# Altium project Micromouse.PrjPcb
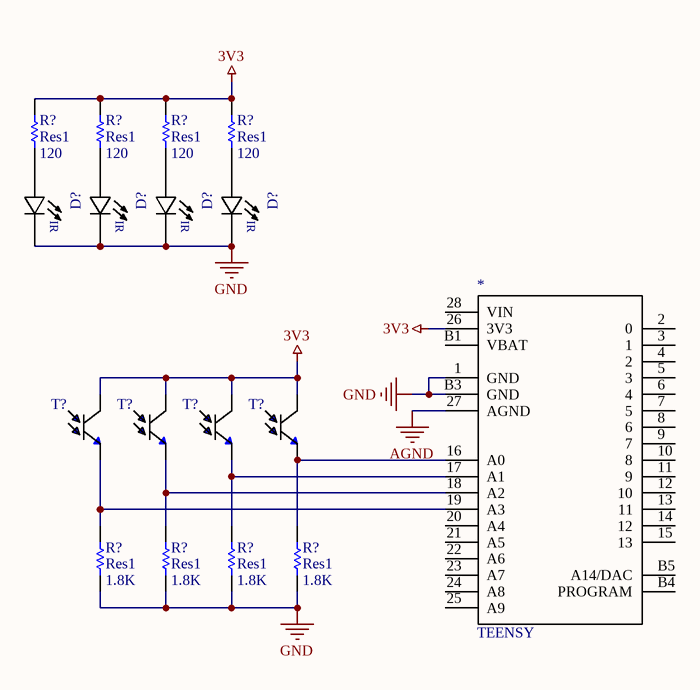
[diagram p0: Sheet1.SchDoc]
1 sheet, 17 parts. Net scope: global (net labels, ports and power ports of the same name join across sheets).

## Sheet Sheet1.SchDoc
size A

### Parts
(Parts that share a designator on the sheet are numbered #1, #2 ... from top to bottom, then left to right.)
*  TEENSY
D?#1  SFH_4545  [*DIO_SFH_4545_SFH_4545(Primary)]  (value not drawn)
D?#2  SFH_4545  [*DIO_SFH_4545_SFH_4545(Primary)]  (value not drawn)
D?#3  SFH_4545  [*DIO_SFH_4545_SFH_4545(Primary)]  (value not drawn)
D?#4  SFH_4545  [*DIO_SFH_4545_SFH_4545(Primary)]  (value not drawn)
R?#1  Res1  value 120  [AXIAL-0.3]
R?#2  Res1  value 120  [AXIAL-0.3]
R?#3  Res1  value 120  [AXIAL-0.3]
R?#4  Res1  value 120  [AXIAL-0.3]
R?#5  Res1  value 1.8K  [AXIAL-0.3]
R?#6  Res1  value 1.8K  [AXIAL-0.3]
R?#7  Res1  value 1.8K  [AXIAL-0.3]
R?#8  Res1  value 1.8K  [AXIAL-0.3]
T?#1  TEFT4300  [*XDCR_TEFT4300_TEFT4300(Primary)]  (value not drawn)
T?#2  TEFT4300  [*XDCR_TEFT4300_TEFT4300(Primary)]  (value not drawn)
T?#3  TEFT4300  [*XDCR_TEFT4300_TEFT4300(Primary)]  (value not drawn)
T?#4  TEFT4300  [*XDCR_TEFT4300_TEFT4300(Primary)]  (value not drawn)

### Nets
3V3: *.26(3V3) R?#1.2 R?#2.2 R?#3.2 R?#4.2 T?#1.C T?#2.C T?#3.C T?#4.C
AGND: *.27(AGND)
GND: *.1(GND) *.B3(GND) D?#1.C D?#2.C D?#3.C D?#4.C R?#5.1 R?#6.1 R?#7.1 R?#8.1
Net*_16: *.16(A0) R?#8.2 T?#4.E
Net*_17: *.17(A1) R?#7.2 T?#3.E
Net*_18: *.18(A2) R?#6.2 T?#2.E
Net*_19: *.19(A3) R?#5.2 T?#1.E
NetD?#1_A: D?#1.A R?#1.1
NetD?#2_A: D?#2.A R?#2.1
NetD?#3_A: D?#3.A R?#3.1
NetD?#4_A: D?#4.A R?#4.1

Not connected (* = marked no-connect by the designer): * 2(0) 3(1) 4(2) 5(3) 6(4) 7(5) 8(6) 9(7) 10(8) 11(9) 12(10) 13(11) 14(12) 15(13) 20(A4) 21(A5) 22(A6) 23(A7) 24(A8) 25(A9) 28(VIN) B1(VBAT) B4(PROGRAM) B5(A14/DAC)

### Notes on the sheet
- (in symbol SFH_4545) IR

### Library data of the parts
* = TEENSY: TEENSY 3.2 + HEADER; Manufacturer 1: Adafruit Industries; Manufacturer Part Number 1: 2756; Supplier 1: Digi-Key; Supplier Part Number 1: 1528-2385-ND; Stock 1: 611; Pricing 1: 1=24.94000 (USD); RoHS: No; ComponentLink1URL: https://media.digikey.com/pdf/Data%20Sheets/Adafruit%20PDFs/2756_Web.pdf?src-supplier=Digi-Key; ComponentLink1Description: https://media.digikey.com/pdf/Data%20Sheets/Adafruit%20PDFs/2756_Web.pdf?src-supplier=Digi-Key
D?#1-D?#4 = SFH_4545: / Infrared _IR_ Emitter 950nm 1.5V 100mA 550mW/sr @ 100mA 10Â° Radial /; MF: OSRAM Opto; Package: Radial Osram Opto; Digi-Key_Purchase_URL: https://www.digikey.com/product-detail/en/osram-opto-semiconductors-inc/SFH-4545/475-2919-ND/2205955?utm_source=snapeda&utm_medium=aggregator&utm_campaign=symbol; MP: SFH 4545; SnapEDA_Link: https://www.snapeda.com/parts/SFH%204545/OSRAM%20Opto%20Semiconductors%20Inc./view-part/78935/?ref=snap; Digi-Key_Part_Number: 475-2919-ND; Value: *
R?#1-R?#8 = Res1: Resistor; Published: 8-Jun-2000; LatestRevisionDate: 17-Jul-2002; LatestRevisionNote: Re-released for DXP Platform.; PackageReference: AXIAL-0.3; Publisher: Altium Limited; PackageDescription: Axial Device, Thru-Hole; 2 Leads; 0.3 in Pin Spacing
T?#1-T?#4 = TEFT4300: Phototransistor 925nm Top View Radial, 3mm Dia _T-1_; MF: Vishay Semiconductor; Digi-Key_Part_Number: 751-1041-ND; Package: Radial Vishay; SnapEDA_Link: https://www.snapeda.com/parts/TEFT4300/Vishay%20Semiconductor%20Opto%20Division/view-part/213585/?ref=snap; MP: TEFT4300; Digi-Key_Purchase_URL: https://www.digikey.com/product-detail/en/vishay-semiconductor-opto-division/TEFT4300/751-1041-ND/1681175?utm_source=snapeda&utm_medium=aggregator&utm_campaign=symbol; Value: *